# Altium schematic sheet encoder.SchDoc
size A4; SheetNumber: 6; SheetTotal: 7
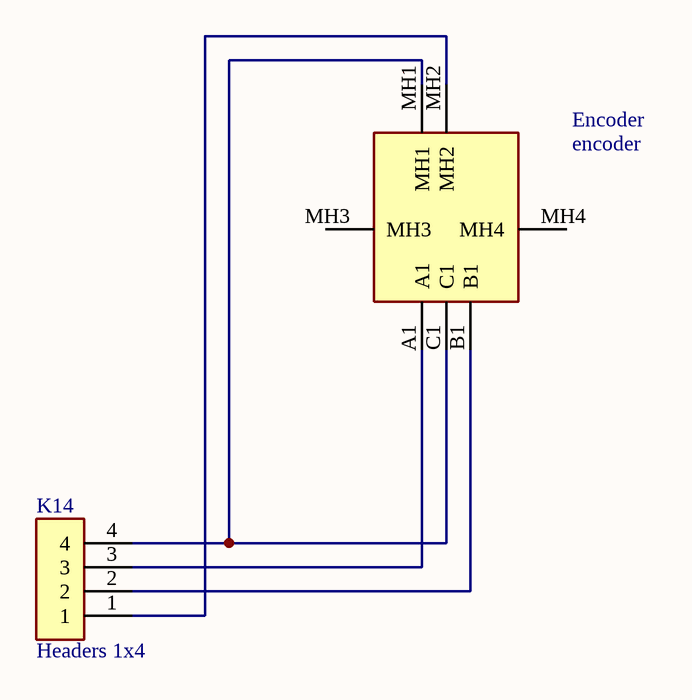
[diagram p0: encoder.SchDoc]

## Parts
Encoder  encoder  [encoder]
K14  Headers 1x4  [Headers 1x4]

## Nets
NetEncoder_A1: Encoder.A1 K14.3
NetEncoder_B1: Encoder.B1 K14.2
NetEncoder_C1: Encoder.C1 Encoder.MH1 K14.4
NetEncoder_MH2: Encoder.MH2 K14.1

Not connected (* = marked no-connect by the designer): Encoder MH3 MH4

## Library data of the parts
Encoder = encoder: Undefined or Miscellaneous; Manufacturer_Name: Alpha (Taiwan); Manufacturer_Part_Number: RE130F-41-175F-12P; Datasheet Link: https://componentsearchengine.com//RE130F-41-175F-12P.pdf; Height: 17.5mm; Mouser2 Part Number: 318-ENC130175F-12PS; Mouser2 Price/Stock: https://www.mouser.com/Search/Refine.aspx?Keyword=318-ENC130175F-12PS
K14 = Headers 1x4: Connector; Manufacturer_Name: TE Connectivity; Manufacturer_Part_Number: 2-826646-0; Datasheet Link: https://componentsearchengine.com/Datasheets/1/2-826646-0.pdf; Height: 8.8mm